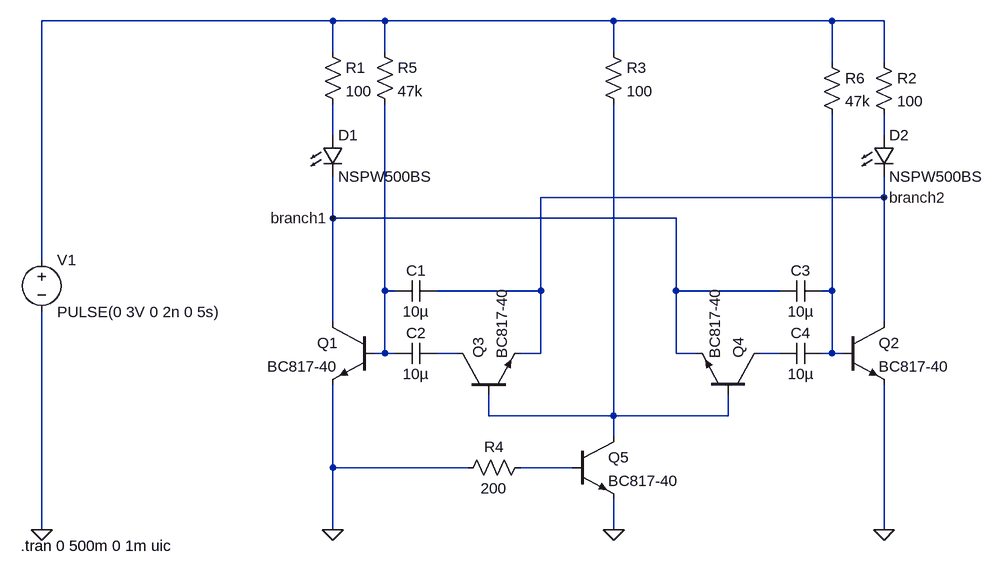
[diagram p0: schematic tuxpin_simulation.asc]
tuxpin_simulation.asc, the LTspice schematic file:
Version 4
SHEET 1 880 680
WIRE -7168 -25232 -7616 -25232
WIRE -7088 -25232 -7168 -25232
WIRE -6736 -25232 -7088 -25232
WIRE -6400 -25232 -6736 -25232
WIRE -6320 -25232 -6400 -25232
WIRE -7168 -25184 -7168 -25232
WIRE -7088 -25184 -7088 -25232
WIRE -6736 -25184 -6736 -25232
WIRE -6400 -25168 -6400 -25232
WIRE -6320 -25168 -6320 -25232
WIRE -7168 -25056 -7168 -25104
WIRE -6320 -25056 -6320 -25088
WIRE -6320 -24960 -6320 -24992
WIRE -6320 -24960 -6848 -24960
WIRE -7168 -24928 -7168 -24992
WIRE -6640 -24928 -7168 -24928
WIRE -7616 -24864 -7616 -25232
WIRE -7088 -24816 -7088 -25104
WIRE -7072 -24816 -7088 -24816
WIRE -6848 -24816 -6848 -24960
WIRE -6848 -24816 -7008 -24816
WIRE -6640 -24816 -6640 -24928
WIRE -6480 -24816 -6640 -24816
WIRE -6400 -24816 -6400 -25088
WIRE -6400 -24816 -6416 -24816
WIRE -7168 -24768 -7168 -24928
WIRE -6320 -24768 -6320 -24960
WIRE -7088 -24720 -7088 -24816
WIRE -7088 -24720 -7104 -24720
WIRE -7072 -24720 -7088 -24720
WIRE -6976 -24720 -7008 -24720
WIRE -6848 -24720 -6848 -24816
WIRE -6848 -24720 -6880 -24720
WIRE -6640 -24720 -6640 -24816
WIRE -6608 -24720 -6640 -24720
WIRE -6480 -24720 -6512 -24720
WIRE -6400 -24720 -6400 -24816
WIRE -6400 -24720 -6416 -24720
WIRE -6384 -24720 -6400 -24720
WIRE -6928 -24624 -6928 -24656
WIRE -6736 -24624 -6736 -25104
WIRE -6736 -24624 -6928 -24624
WIRE -6560 -24624 -6560 -24656
WIRE -6560 -24624 -6736 -24624
WIRE -6736 -24592 -6736 -24624
WIRE -7168 -24544 -7168 -24672
WIRE -6960 -24544 -7168 -24544
WIRE -6800 -24544 -6880 -24544
WIRE -7616 -24448 -7616 -24784
WIRE -7168 -24448 -7168 -24544
WIRE -6736 -24448 -6736 -24496
WIRE -6320 -24448 -6320 -24672
FLAG -6736 -24448 0
FLAG -7168 -24448 0
FLAG -6320 -24448 0
FLAG -7616 -24448 0
FLAG -7168 -24928 branch1
FLAG -6320 -24960 branch2
SYMBOL LED -7184 -25056 R0
SYMATTR InstName D1
SYMATTR Value NSPW500BS
SYMATTR Description Diode
SYMATTR Type diode
SYMBOL LED -6336 -25056 R0
SYMATTR InstName D2
SYMATTR Value NSPW500BS
SYMATTR Description Diode
SYMATTR Type diode
SYMBOL res -7184 -25200 R0
SYMATTR InstName R1
SYMATTR Value 100
SYMBOL res -6336 -25184 R0
SYMATTR InstName R2
SYMATTR Value 100
SYMBOL npn -7104 -24768 M0
SYMATTR InstName Q1
SYMATTR Value BC817-40
SYMBOL npn -6384 -24768 R0
SYMATTR InstName Q2
SYMATTR Value BC817-40
SYMBOL npn -6976 -24656 R270
SYMATTR InstName Q3
SYMATTR Value BC817-40
SYMBOL npn -6512 -24656 M270
SYMATTR InstName Q4
SYMATTR Value BC817-40
SYMBOL voltage -7616 -24880 R0
WINDOW 123 0 0 Left 0
WINDOW 39 0 0 Left 0
SYMATTR InstName V1
SYMATTR Value PULSE(0 3V 0 2n 0 5s)
SYMBOL cap -7008 -24832 R90
WINDOW 0 0 32 VBottom 2
WINDOW 3 32 32 VTop 2
SYMATTR InstName C1
SYMATTR Value 10µ
SYMBOL cap -7008 -24736 R90
WINDOW 0 0 32 VBottom 2
WINDOW 3 32 32 VTop 2
SYMATTR InstName C2
SYMATTR Value 10µ
SYMBOL cap -6416 -24832 R90
WINDOW 0 0 32 VBottom 2
WINDOW 3 32 32 VTop 2
SYMATTR InstName C3
SYMATTR Value 10µ
SYMBOL cap -6416 -24736 R90
WINDOW 0 0 32 VBottom 2
WINDOW 3 32 32 VTop 2
SYMATTR InstName C4
SYMATTR Value 10µ
SYMBOL npn -6800 -24592 R0
SYMATTR InstName Q5
SYMATTR Value BC817-40
SYMBOL res -6752 -25200 R0
SYMATTR InstName R3
SYMATTR Value 100
SYMBOL res -6864 -24560 R90
WINDOW 0 0 56 VBottom 2
WINDOW 3 32 56 VTop 2
SYMATTR InstName R4
SYMATTR Value 200
SYMBOL res -7104 -25200 R0
SYMATTR InstName R5
SYMATTR Value 47k
SYMBOL res -6416 -25184 R0
SYMATTR InstName R6
SYMATTR Value 47k
TEXT -7648 -24424 Left 2 !.tran 0 500m 0 1m uic

The netlist it stands for:
* tuxpin_simulation.asc
D1 N002 branch1 NSPW500BS
D2 N003 branch2 NSPW500BS
R1 N001 N002 100
R2 N001 N003 100
Q1 branch1 N004 0 0 BC817-40
Q2 branch2 N005 0 0 BC817-40
Q3 N006 N008 branch2 0 BC817-40
Q4 N007 N008 branch1 0 BC817-40
V1 N001 0 PULSE(0 3V 0 2n 0 5s)
C1 branch2 N004 10µ
C2 N006 N004 10µ
C3 N005 branch1 10µ
C4 N005 N007 10µ
Q5 N008 N009 0 0 BC817-40
R3 N001 N008 100
R4 N009 0 200
R5 N001 N004 47k
R6 N001 N005 47k
.model D D
.lib standard.dio
.model NPN NPN
.model PNP PNP
.lib standard.bjt
.tran 0 500m 0 1m uic
.backanno
.end

* Results of the author's LTspice run, read from the files saved beside the schematic
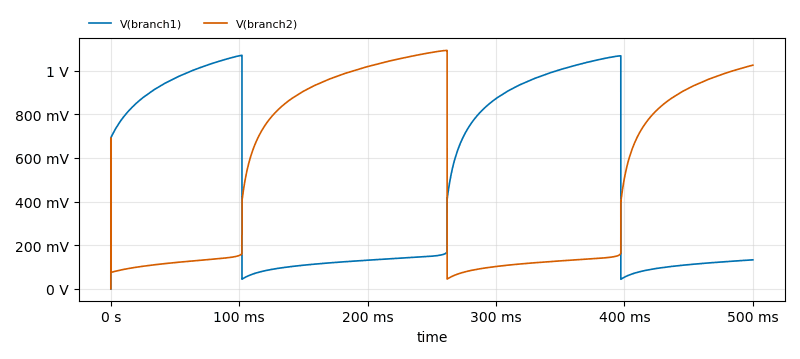
[diagram p1: Transient Analysis of tuxpin_simulation.asc, plotted from the saved traces]
* Transient Analysis, 1 run:
*   V(branch1): min 0 V, max 1.071 V, average 500.8 mV, rms 651.8 mV, last 132.8 mV
*   V(branch2): min 0 V, max 1.093 V, average 535.2 mV, rms 675.9 mV, last 1.025 V